# EAGLE design DG5v2_0_3 (EAGLE 9.5.2)
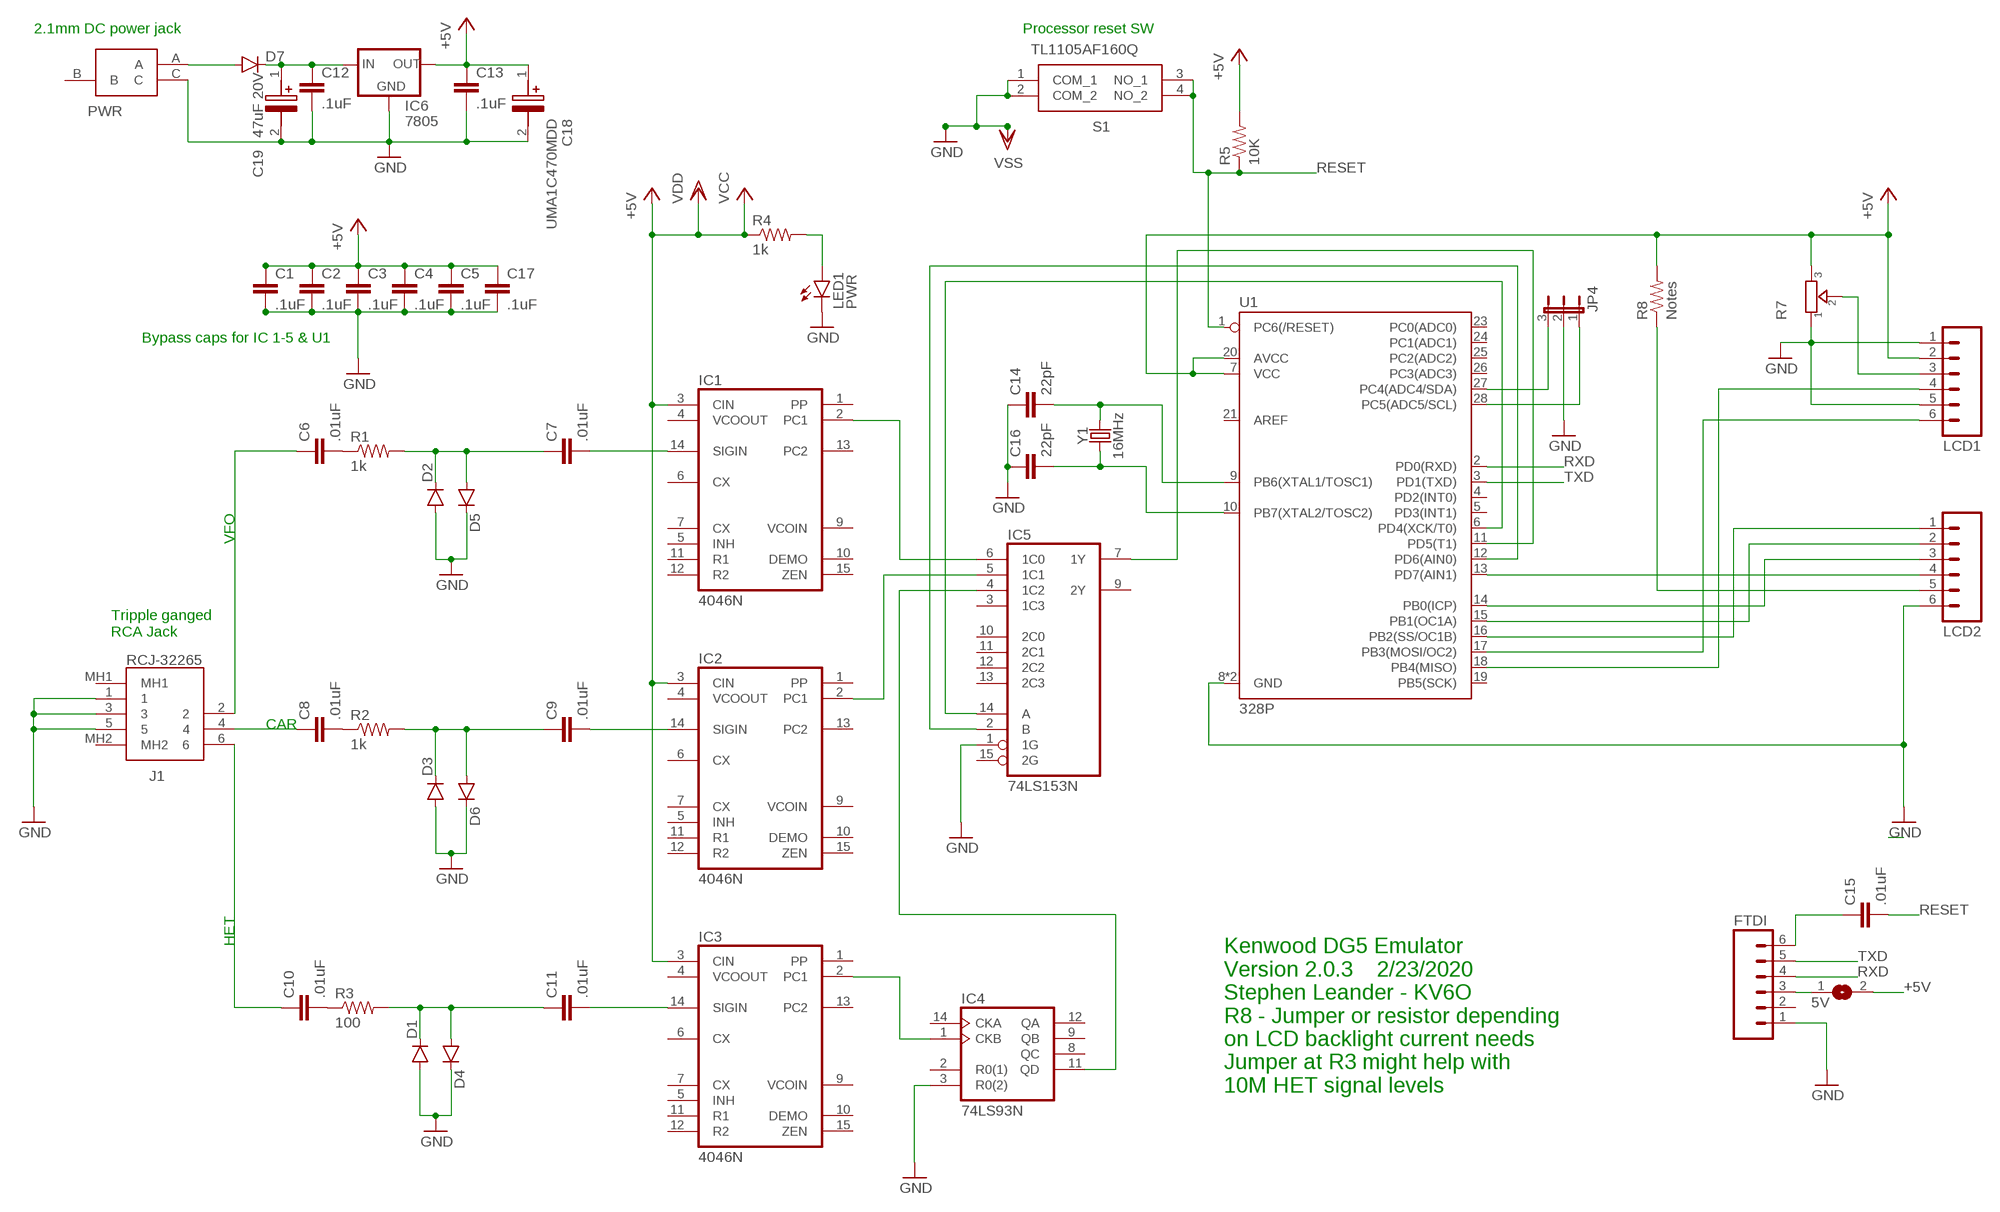
[diagram p0: schematic, sheet 1]

## Parts
5V  SJ  [SJ]
C1  .1uF  CAPKIT  [CAP-PTH-SMALL-KIT]
C2  .1uF  CAPKIT  [CAP-PTH-SMALL-KIT]
C3  .1uF  CAPKIT  [CAP-PTH-SMALL-KIT]
C4  .1uF  CAPKIT  [CAP-PTH-SMALL-KIT]
C5  .1uF  CAPKIT  [CAP-PTH-SMALL-KIT]
C6  .01uF  CAPKIT  [CAP-PTH-SMALL-KIT]
C7  .01uF  CAPKIT  [CAP-PTH-SMALL-KIT]
C8  .01uF  CAPKIT  [CAP-PTH-SMALL-KIT]
C9  .01uF  CAPKIT  [CAP-PTH-SMALL-KIT]
C10  .01uF  CAPKIT  [CAP-PTH-SMALL-KIT]
C11  .01uF  CAPKIT  [CAP-PTH-SMALL-KIT]
C12  .1uF  CAPKIT  [CAP-PTH-SMALL-KIT]
C13  .1uF  CAPKIT  [CAP-PTH-SMALL-KIT]
C14  22pF  CAPPTH  [CAP-PTH-SMALL]
C15  .01uF  CAPKIT  [CAP-PTH-SMALL-KIT]
C16  22pF  CAPPTH  [CAP-PTH-SMALL]
C17  .1uF  CAPKIT  [CAP-PTH-SMALL-KIT]
C18  UMA1C470MDD  [CAPPRD250W45D680H600]
C19  47uF 20V  UMA1C470MDD  [CAPPRD250W45D680H600]
D1  DIODE1N4148  [DIODE-1N4148]
D2  DIODE1N4148  [DIODE-1N4148]
D3  DIODE1N4148  [DIODE-1N4148]
D4  DIODE1N4148  [DIODE-1N4148]
D5  DIODE1N4148  [DIODE-1N4148]
D6  DIODE1N4148  [DIODE-1N4148]
D7  DIODE  [DIODE-1N4001-KIT]
FTDI  M06SIP  [1X06]
IC1  4046N  [DIL16]
IC2  4046N  [DIL16]
IC3  4046N  [DIL16]
IC4  74LS93N  [DIL14]
IC5  74LS153N  [DIL16]
IC6  7805  V_REG_78XXSINK  [TO220-IGO]
J1  RCJ-32265  [RCJ32265]
JP4  JP2E  [JP2]
LCD1  M06SIP  [1X06]
LCD2  M06SIP  [1X06]
LED1  PWR  TLLG4400  [LED3MM]
PWR  163-179PH-EX  [163179PHEX]
R1  1k  RESISTORPTH-1/6W  [1/6W-RES]
R2  1k  RESISTORPTH-1/6W  [1/6W-RES]
R3  100  RESISTORPTH-1/6W  [1/6W-RES]
R4  1k  RESISTORPTH-1/6W  [1/6W-RES]
R5  10K  RESISTORPTH-1/6W  [1/6W-RES]
R7  TRIMMER-3306F  [TRIMMER_3306F]
R8  Notes  RESISTORPTH-1/6W  [1/6W-RES]
S1  TL1105AF160Q  [TL1105AF160Q]
U1  328P  ATMEGA328P_PDIP  [DIP28]
Y1  16MHz  CRYSTAL-16MHZPTH-HC49US  [HC49US]

## Nets
+5V [POWER]: 5V.2 C1.1 C2.1 C3.1 C4.1 C5.1 C13.1 C17.1 C18.1(+) IC1.3(CIN) IC2.3(CIN) IC3.3(CIN) IC6.OUT LCD1.2 R4.1 R5.2 R7.3 R8.2 U1.7(VCC) U1.20(AVCC) ; supply symbol labelled VDD, VCC
CAR: C8.1 J1.4
GND: C1.2 C2.2 C3.2 C4.2 C5.2 C12.2 C13.2 C14.1 C16.1 C17.2 C18.2(-) C19.2(-) D1.A D2.A D3.A D4.C D5.C D6.C FTDI.1 IC4.3(R0(2)) IC5.1(1G) IC6.GND J1.1 J1.3 J1.5 JP4.2 LCD1.1 LCD1.5 LCD2.6 LED1.K(C) PWR.C R7.1 S1.1(COM_1) S1.2(COM_2) U1.8(GND) U1.22(GND) ; supply symbol labelled VSS
HET: C10.1 J1.6
N$1: C7.2 IC1.14(SIGIN)
N$2: IC1.2(PC1) IC5.6(1C0)
N$3: IC2.2(PC1) IC5.5(1C1)
N$4: C8.2 R2.1
N$5: C6.2 R1.1
N$6: C7.1 D2.C D5.A R1.2
N$7: IC3.2(PC1) IC4.1(CKB)
N$8: IC4.11(QD) IC5.4(1C2)
N$9: C9.1 D3.C D6.A R2.2
N$10: 5V.1 FTDI.3
N$11: C9.2 IC2.14(SIGIN)
N$12: C11.2 IC3.14(SIGIN)
N$13: C11.1 D1.C D4.A R3.2
N$14: C10.2 R3.1
N$17: IC5.7(1Y) U1.11(PD5(T1))
N$18: IC5.2(B) U1.12(PD6(AIN0))
N$19: IC5.14(A) U1.6(PD4(XCK/T0))
N$20: C14.2 U1.9(PB6(XTAL1/TOSC1)) Y1.2
N$21: LED1.A R4.2
N$22: JP4.3 U1.27(PC4(ADC4/SDA))
N$23: JP4.1 U1.28(PC5(ADC5/SCL))
N$24: C16.2 U1.10(PB7(XTAL2/TOSC2)) Y1.1
N$25: LCD2.5 R8.1
N$26: LCD1.3 R7.2
N$27: LCD1.4 U1.18(PB4(MISO))
N$28: LCD1.6 U1.17(PB3(MOSI/OC2))
N$29: C15.1 FTDI.6
N$32: D7.A PWR.A
N$34: LCD2.1 U1.16(PB2(SS/OC1B))
N$35: LCD2.2 U1.15(PB1(OC1A))
N$36: LCD2.3 U1.14(PB0(ICP))
N$37: LCD2.4 U1.13(PD7(AIN1))
RESET: C15.2 R5.1 S1.3(NO_1) S1.4(NO_2) U1.1(PC6(/RESET))
RXD: FTDI.4 U1.2(PD0(RXD))
TXD: FTDI.5 U1.3(PD1(TXD))
VFO: C6.1 J1.2
VIN [POWER]: C12.1 C19.1(+) D7.C IC6.IN
Unconnected: FTDI.2 IC1.1(PP) IC1.4(VCOOUT) IC1.5(INH) IC1.6(CX) IC1.7(CX) IC1.9(VCOIN) IC1.10(DEMO) IC1.11(R1) IC1.12(R2) IC1.13(PC2) IC1.15(ZEN) IC2.1(PP) IC2.4(VCOOUT) IC2.5(INH) IC2.6(CX) IC2.7(CX) IC2.9(VCOIN) IC2.10(DEMO) IC2.11(R1) IC2.12(R2) IC2.13(PC2) IC2.15(ZEN) IC3.1(PP) IC3.4(VCOOUT) IC3.5(INH) IC3.6(CX) IC3.7(CX) IC3.9(VCOIN) IC3.10(DEMO) IC3.11(R1) IC3.12(R2) IC3.13(PC2) IC3.15(ZEN) IC4.2(R0(1)) IC4.8(QC) IC4.9(QB) IC4.12(QA) IC4.14(CKA) IC5.3(1C3) IC5.9(2Y) IC5.10(2C0) IC5.11(2C1) IC5.12(2C2) IC5.13(2C3) IC5.15(2G) J1.MH1 J1.MH2 PWR.B U1.4(PD2(INT0)) U1.5(PD3(INT1)) U1.19(PB5(SCK)) U1.21(AREF) U1.23(PC0(ADC0)) U1.24(PC1(ADC1)) U1.25(PC2(ADC2)) U1.26(PC3(ADC3))

## Notes on the sheet
- 2.1mm DC power jack | Processor reset SW
- Bypass caps for IC 1-5 & U1
- VFO
- Tripple ganged
  RCA Jack
- CAR
- HET
- Kenwood DG5 Emulator
  Version 2.0.3    2/23/2020
  Stephen Leander - KV6O
  R8 - Jumper or resistor depending 
  on LCD backlight current needs
  Jumper at R3 might help with
  10M HET signal levels

## Power pins joined to a net without a drawn wire
+5V: IC1.16(VDD) IC2.16(VDD) IC3.16(VDD) IC4.5(VCC) IC5.16(VCC)
GND: IC1.8(VSS) IC2.8(VSS) IC3.8(VSS) IC4.10(GND) IC5.8(GND)

## Library data of the parts
5V = jumper:SJ: SMD solder JUMPER
C1-C13 C15 C17 = SparkFun-Passives:CAP: Capacitor Standard 0603 ceramic capacitor, and 0.1" leaded capacitor.
C14 C16 = SparkFun:CAP: Capacitor Standard 0603 ceramic capacitor, and 0.1" leaded capacitor.
C18 C19 = SamacSys_Parts:UMA1C470MDD: Nichicon 47F +/-20% 16 V dc Through Hole Radial Aluminium Electrolytic Capacitor Source: Datasheet <https://componentsearchengine.com/Datasheets/1/UMA1C470MDD.pdf>; DESCRIPTION: Nichicon 47F +/-20% 16 V dc Through Hole Radial Aluminium Electrolytic Capacitor; HEIGHT: 6mm; MANUFACTURER_NAME: Nichicon; MANUFACTURER_PART_NUMBER: UMA1C470MDD; MOUSER_PART_NUMBER: 647-UMA1C470MDD
D1-D7 = SparkFun-DiscreteSemi:DIODE: Diode These are standard reverse protection diodes and small signal diodes. SMA package can handle up to about 1A. SOD-323 can handle about 200mA. What the SOD-323 package when ordering, there are some mfgs out there that are 5-pin packages.
FTDI LCD1 LCD2 = SparkFun-Connectors:M06: Header 6 Standard 6-pin 0.1" header. Use with straight break away headers (SKU : PRT-00116), right angle break away headers (PRT-00553), swiss pins (PRT-00743), machine pins (PRT-00117), and female headers (PRT-00115). Molex polarized connector foot print use with SKU : PRT-08094 with associated crimp pins and housings. NOTES ON THE VARIANTS LOCK and LOCK_LONGPADS... This footprint was designed to help hold the alignment of a through-hole component (i.e. 6-pin header) while soldering it into place. You may notice that each hole has been shifted either up or down by 0.005 of an inch from it's more standard position (which is a perfectly straight line). This slight alteration caused the pins (the squares in the middle) to touch the edges of the holes. Because they are alternating, it causes a "brace" to hold the component in place. 0.005 has proven to be the perfect amount of "off-center" position when using our standard breakaway headers. Although looks a little odd when you look at the bare footprint, once you have a header in there, the alteration is very hard to notice. Also,if you push a header all the way into place, it is covered up entirely on the bottom side. This idea of altering the position of holes to aid alignment will be further integrated into the Sparkfun Library for other footprints. It can help hold any component with 3 or more connection pins.
IC1-IC3 = 40xx:4046: Micropower PLL
IC4 = 74xx-us:74*93: Decade, divide by twelve and binary COUNTER
IC5 = 74xx-us:74*153: Dual 4-line to 1-line data SELECTOR/MULTIPLEXER
IC6 = SparkFun-PowerIC:V_REG_78XX: Voltage Regulator Standard 7805 5V regulator. IGO (Input Ground Output). Spark Fun Electronics SKU : COM-00107
J1 = SamacSys_Parts:RCJ-32265: RCA Phono Connectors RCA jack, 3P, 1 x 3, rt, through hole, BE/GR/RD Source: Datasheet <https://componentsearchengine.com/Datasheets/1/RCJ-32265.pdf>; DESCRIPTION: RCA Phono Connectors RCA jack, 3P, 1 x 3, rt, through hole, BE/GR/RD; HEIGHT: 19.2mm; MANUFACTURER_NAME: CUI; MANUFACTURER_PART_NUMBER: RCJ-32265; MOUSER_PART_NUMBER: 490-RCJ-32265; MOUSER_PRICE-STOCK: https://www.mouser.com/Search/Refine.aspx?Keyword=490-RCJ-32265
JP4 = jumper:JP2E: JUMPER
LED1 = led:TLLG4400: Low Current (2mA) LED 3 mm Tinted Diffused Package color GREEN Source: Data sheet <http://www.farnell.com/datasheets/391098.pdf>; MF: VISHAY SEMICONDUCTOR; OC_FARNELL: 1612435
PWR = SamacSys_Parts:163-179PH-EX: DC Power Connectors PCB 2.1MM Source: Datasheet <https://componentsearchengine.com/Datasheets/1/163-179PH-EX.pdf>; DESCRIPTION: DC Power Connectors PCB 2.1MM; HEIGHT: 11mm; MANUFACTURER_NAME: Kobiconn; MANUFACTURER_PART_NUMBER: 163-179PH-EX; MOUSER_PART_NUMBER: 163-179PH-EX; MOUSER_PRICE-STOCK: https://www.mouser.com/Search/Refine.aspx?Keyword=163-179PH-EX
R1-R5 R8 = SparkFun-Passives:RESISTOR: Resistor Basic schematic elements and footprints for 0603, 1206, and PTH resistors.
R7 = dp_devices:TRIMMER: Trimmer resistor
S1 = SamacSys_Parts:TL1105AF160Q: E-SWITCH - TL1105AF160Q - SWITCH, TACTILE SPST, 50mA, THROUGH HOLE Source: Datasheet <https://componentsearchengine.com/Datasheets/1/TL1105AF160Q.pdf>; DESCRIPTION: E-SWITCH - TL1105AF160Q - SWITCH, TACTILE SPST, 50mA, THROUGH HOLE; HEIGHT: 6.8mm; MANUFACTURER_NAME: E-Switch; MANUFACTURER_PART_NUMBER: TL1105AF160Q; MOUSER_PART_NUMBER: 612-TL1105A; MOUSER_PRICE-STOCK: https://www.mouser.com/Search/Refine.aspx?Keyword=612-TL1105A
U1 = SparkFun-IC-Microcontroller:ATMEGA328P_PDIP: Atmel 328P Through hole ATMEGA328P uC used in the Arduino 32kb flash, 1k EEPROM, 2k SRAM Datasheet <http://www.sparkfun.com/datasheets/Components/SMD/ATMega328.pdf> SparkFun Products Storefront component: AVR 28 Pin 20MHz 32K 6A/D - ATMega328P <https://www.sparkfun.com/products/9061> (COM-09061) SparkFun Simon Says - Through-Hole Soldering Kit <https://www.sparkfun.com/products/10547> (KIT-10547) SparkFun Learn to Solder - Simon Says <https://www.sparkfun.com/products/13708> (KIT-13708) SparkFun BigTime Watch Kit <https://www.sparkfun.com/products/11734> (KIT-11734) SparkFun ClockIt <https://www.sparkfun.com/products/10930> (KIT-10930) SparkFun Serial Enabled LCD Kit <https://www.sparkfun.com/products/10097> (LCD-10097) SparkFun Simon Tilts - Through Hole Soldering Kit <https://www.sparkfun.com/products/12634> (KIT-12634) SparkFun Frequency Counter Kit <https://www.sparkfun.com/products/10140> (KIT-10140) FabFM Radio Kit <https://www.sparkfun.com/products/11043> (KIT-11043) SparkFun Binary Blaster Kit <https://www.sparkfun.com/products/12037> (KIT-12037) SparkFun Metro-Gnome <https://www.sparkfun.com/products/9236> (KIT-09236) ATmega328 with Arduino Optiboot (Uno) <https://www.sparkfun.com/products/10524> (DEV-10524); PROD_ID: IC-09136
Y1 = SparkFun-Clocks:CRYSTAL-16MHZ: 16MHz Crystal Digikey Example <http://www.digikey.com/product-search/en?keywords=535-9122-1-ND> Frequency: 16MHz Frequency Stability: ±50ppm Frequency Tolerance: ±20ppm Load Capacitance: 18pF SparkFun Products: Pro Micro -5V/16MHz <https://www.sparkfun.com/products/12640> SparkFun Serial Enabled LCD Kit <https://www.sparkfun.com/products/10097>; PROD_ID: XTAL-08181; SF_ID: COM-00536

## Net classes
0 default: width 0.203 mm
1 POWER: width 0.305 mm

## Board
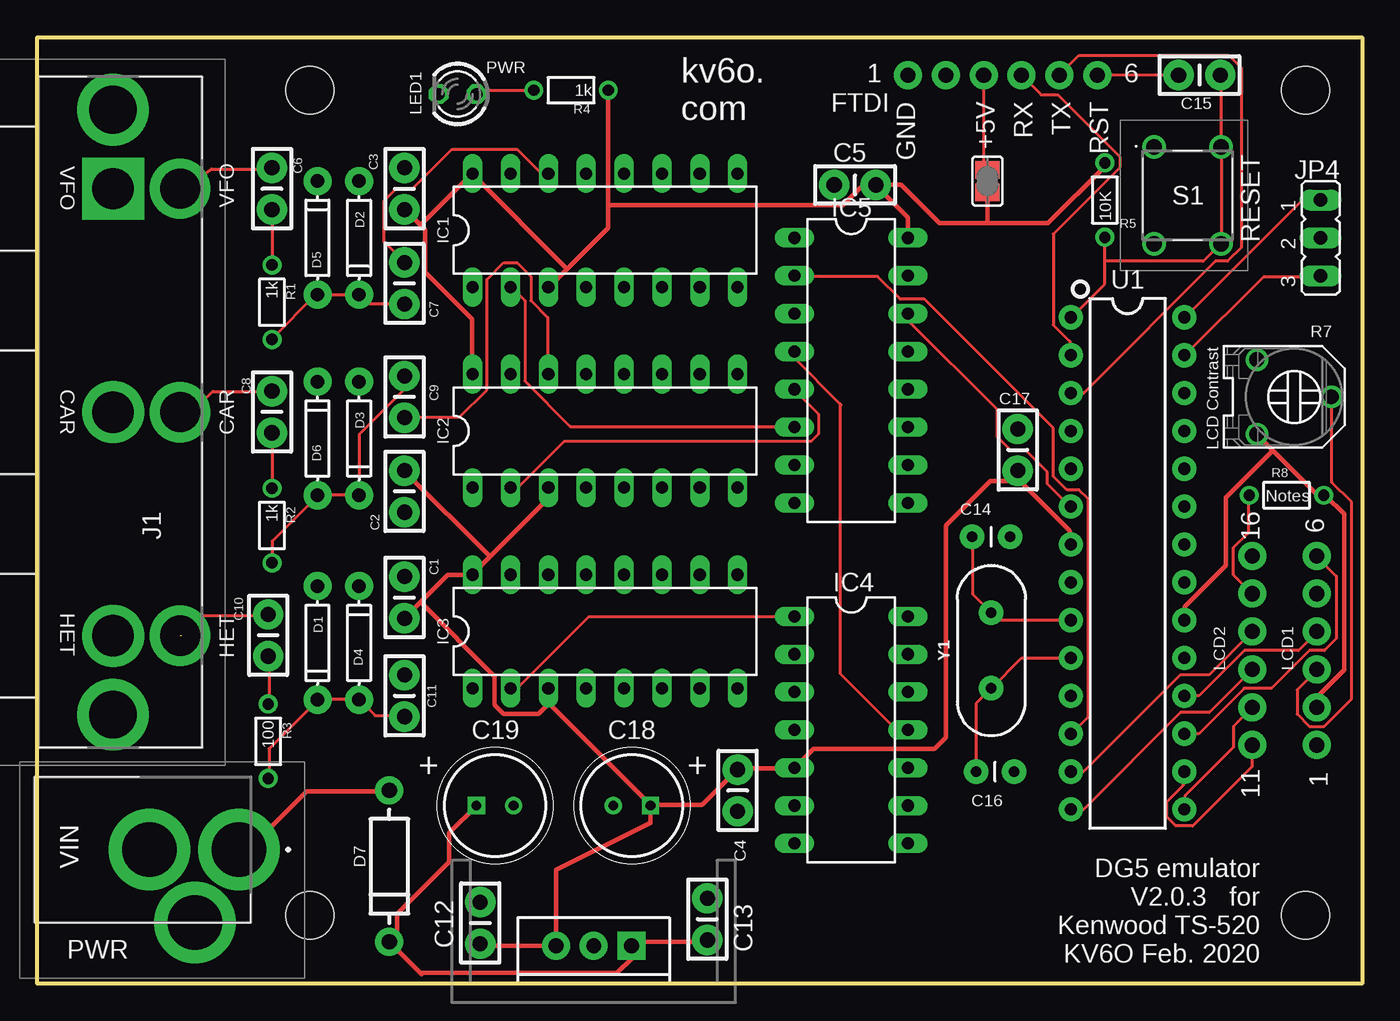
[diagram p1: board, top side]
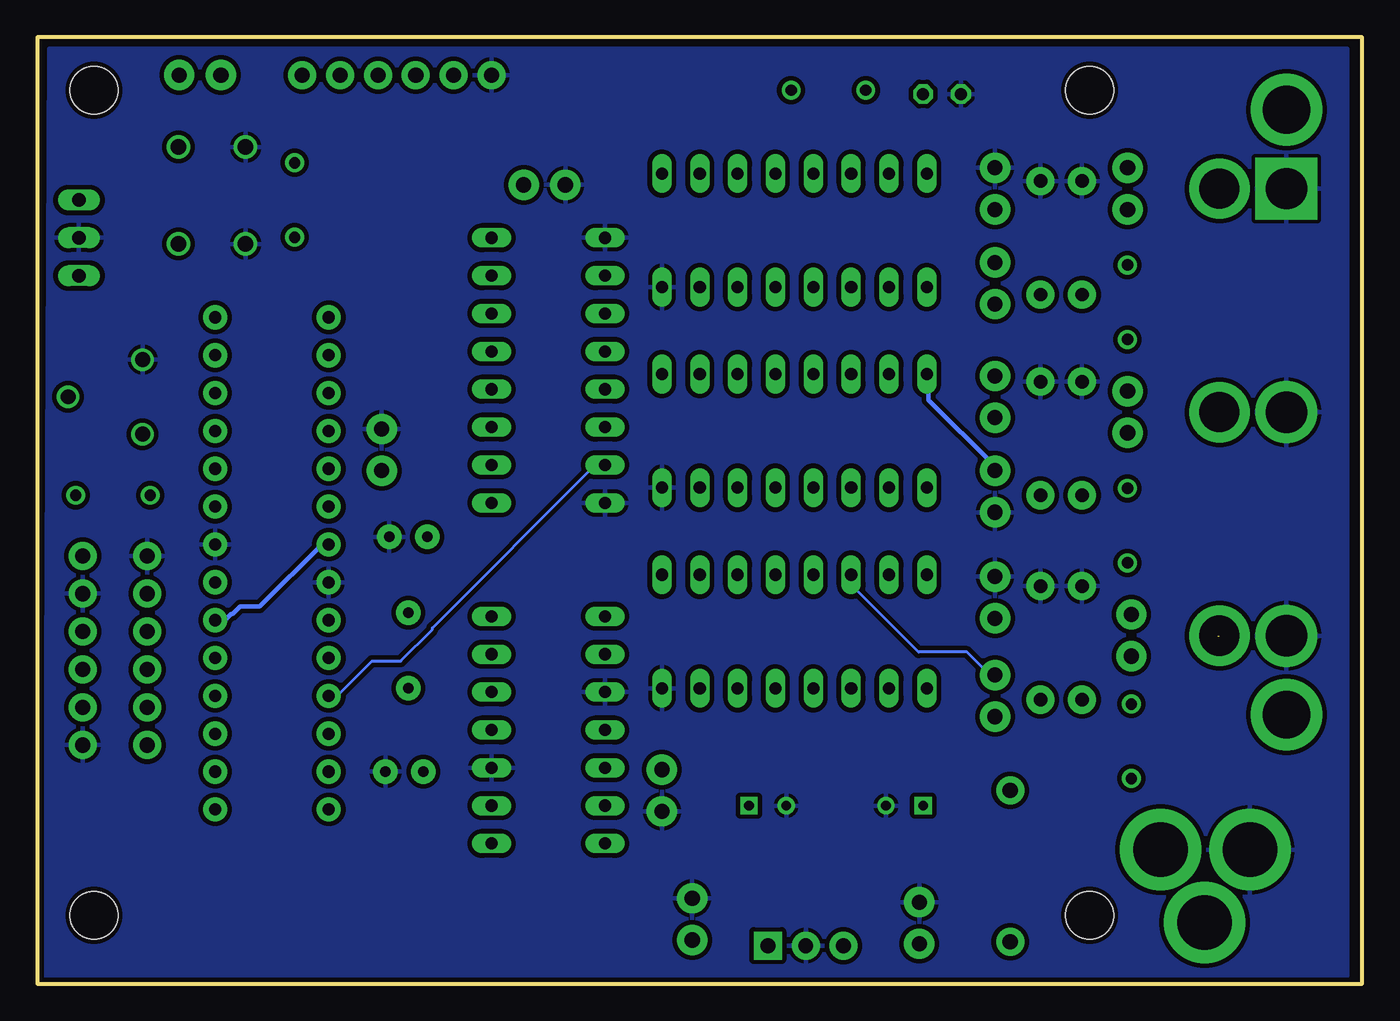
[diagram p2: board, bottom side, seen from below]

Size 88.9 x 63.5 mm. Coordinates in mm from the lower left corner, seen from the top.
Outline: 0,0 0,63.5 88.9,63.5 88.9,0 0,0
Copper layers (1*16): Top 0.035mm / dielectric 1.5mm / Bottom 0.035mm
Design rules "ITEADstudio_DRC *": minimum track width 8mil, minimum drill 12mil, track to track 8mil, track to pad 8mil, pad to pad 8mil, via to via 8mil, smd to smd 0mil, copper to edge 10mil, drill to drill 10mil, minimum pad ring 10mil, minimum via ring 6mil, stop-mask expansion 2mil, vias tented up to drill 100mil, thermal gap 10mil
Holes 3.2 mm at 18.29,59.94 18.29,4.57 85.09,4.57 85.09,59.94

### Footprints (pad centres in the part's own frame; a part is rotated, then mirrored left to right if it is on the bottom)
SJ = smd 1.168 x 1.6: 1 -0.762,0; 2 0.762,0
CAP-PTH-SMALL-KIT = drill 1.016 pad 2.032: 1 -1.397,0; 2 1.397,0
CAP-PTH-SMALL = drill 0.7 pad 1.651: 1 0,0; 2 2.54,0
CAPPRD250W45D680H600 = drill 0.65 pad 1.05 square: 1 0,0 | drill 0.65 pad 1.05: 2 2.5,0
DIODE-1N4148 = drill 0.9 pad 1.88: A -3.81,0; C 3.81,0
DIODE-1N4001-KIT = drill 1.016 pad 1.88: A -5.08,0; C 5.08,0
1X06 = drill 1.016 pad 1.88: 1 0,0; 2 2.54,0; 3 5.08,0; 4 7.62,0; 5 10.16,0; 6 12.7,0
DIL16 = drill 0.813 long: 1 -8.89,-3.81; 2 -6.35,-3.81; 3 -3.81,-3.81; 4 -1.27,-3.81; 5 1.27,-3.81; 6 3.81,-3.81; 7 6.35,-3.81; 8 8.89,-3.81; 9 8.89,3.81; 10 6.35,3.81; 11 3.81,3.81; 12 1.27,3.81; 13 -1.27,3.81; 14 -3.81,3.81; 15 -6.35,3.81; 16 -8.89,3.81
DIL14 = drill 0.813 long: 1 -7.62,-3.81; 2 -5.08,-3.81; 3 -2.54,-3.81; 4 0,-3.81; 5 2.54,-3.81; 6 5.08,-3.81; 7 7.62,-3.81; 8 7.62,3.81; 9 5.08,3.81; 10 2.54,3.81; 11 0,3.81; 12 -2.54,3.81; 13 -5.08,3.81; 14 -7.62,3.81
TO220-IGO = drill 1 pad 1.88: GND 0,0; OUT 2.54,0 | drill 1 pad 1.88 square: IN -2.54,0
RCJ32265 = drill 2.773 pad 4.16 square: 1 0,0 | drill 2.693 pad 4.039: 2 0,-4.5; 4 -15,-4.5; 6 -30,-4.5 | drill 2.773 pad 4.16: 3 -15,0; 5 -30,0 | drill 3.202 pad 4.802: MH1 5.3,0; MH2 -35.3,0
JP2 = drill 0.914 long: 1 -2.54,0; 2 0,0; 3 2.54,0
LED3MM = drill 0.813 octagon: A -1.27,0; K 1.27,0
163179PHEX = drill 3.64 pad 5.46: A 5.15,1.365; B 2.2,-3.535; C -0.85,1.365
1/6W-RES = drill 0.762: 1 -2.5,0; 2 2.5,0
TRIMMER_3306F = drill 1: 1 -2.5,-2.5; 2 0,2.5; 3 2.5,-2.5
TL1105AF160Q = drill 1.05 pad 1.575: 1 0,0; 2 0,-6.5; 3 4.5,0; 4 4.5,-6.5
DIP28 = drill 0.813 pad 1.626: 1 -16.51,-3.81; 2 -13.97,-3.81; 3 -11.43,-3.81; 4 -8.89,-3.81; 5 -6.35,-3.81; 6 -3.81,-3.81; 7 -1.27,-3.81; 8 1.27,-3.81; 9 3.81,-3.81; 10 6.35,-3.81; 11 8.89,-3.81; 12 11.43,-3.81; 13 13.97,-3.81; 14 16.51,-3.81; 15 16.51,3.81; 16 13.97,3.81; 17 11.43,3.81; 18 8.89,3.81; 19 6.35,3.81; 20 3.81,3.81; 21 1.27,3.81; 22 -1.27,3.81; 23 -3.81,3.81; 24 -6.35,3.81; 25 -8.89,3.81; 26 -11.43,3.81; 27 -13.97,3.81; 28 -16.51,3.81
HC49US = drill 0.7 pad 1.651: 1 -2.54,0; 2 2.54,0

### Placement (x,y rotation side)
5V  63.75,53.85 270 top
C1  24.64,25.91 90 top
C2  24.64,33.02 270 top
C3  24.64,53.34 90 top
C4  46.99,12.95 270 top
C5  54.86,53.59 180 top
C6  15.75,53.34 270 top
C7  24.64,46.99 90 top
C8  15.75,38.35 270 top
C9  24.64,39.37 270 top
C10  15.49,23.37 270 top
C11  24.64,19.3 90 top
C12  44.96,4.32 90 top
C13  29.72,4.06 90 top
C14  65.28,29.97 180 top
C15  77.98,60.96 0 top
C16  65.53,14.22 180 top
C17  65.79,35.81 90 top
C18  41.15,11.94 180 top
C19  29.46,11.94 0 top
D1  18.8,22.86 270 top
D2  21.59,50.04 270 top
D3  21.59,36.58 270 top
D4  21.59,22.86 90 top
D5  18.8,50.04 90 top
D6  18.8,36.58 90 top
D7  23.62,7.87 270 top
FTDI  58.42,60.96 0 top
IC1  38.1,50.55 0 top
IC2  38.1,37.08 0 top
IC3  38.1,23.62 0 top
IC4  54.61,17.02 270 top
IC5  54.61,41.15 270 top
IC6  37.34,2.54 180 top
J1  5.08,53.34 90 top
JP4  86.11,50.04 270 top
LCD1  85.85,16 90 top
LCD2  81.53,16 90 top
LED1  28.19,59.69 180 top
PWR  8.38,7.62 0 top
R1  15.75,45.72 270 top
R2  15.75,30.73 270 top
R3  15.49,16.26 270 top
R4  35.81,59.94 180 top
R5  71.63,52.58 90 top
R7  84.33,39.37 270 top
R8  83.82,32.77 0 top
S1  74.93,56.13 0 top
U1  73.15,28.19 270 top
Y1  64.01,22.35 90 top

### Tracks (layer width: path | path; a pad name or v marks a point on that pad's centre or on a via)
+5V
  Top 0.305: IC5.16 58.42,51.41 56.29,53.54 C5.1 | 38.3,52.22 38.3,50.7 35.56,47.95 | 38.3,52.22 R4.1 | 35.56,47.95 34.34,46.74 IC1.3 | 25.7,50.9 24.69,51.92 C3.1 | 25.7,50.9 26.01,50.6 26.01,47.75 29.16,44.6 29.16,40.95 IC2.16 | 25.7,50.9 29.16,54.36 IC1.16 29.26,54.25 35.56,47.95 | 38.3,52.22 54.05,52.22 55.27,53.44 56.19,53.44 C5.1 | U1.7 69.29,29.46 69.29,30.38 65.84,33.83 65.84,34.34 C17.1 65.73,33.73 63.96,33.73 60.96,30.73 60.96,16.51 60.2,15.75 52.07,15.75 IC4.5 | 82.91,35.76 81.89,36.78 R7.3 | 82.91,35.76 85.85,32.82 86.26,32.82 R8.2 86.46,32.72 87.68,31.5 87.68,21.03 85.85,19.2 LCD1.2 | 82.91,35.76 79.76,32.61 79.76,28.04 77.01,25.3 77.01,24.38 U1.20 | 25.7,25.6 24.69,24.59 C1.1 | 25.7,25.6 27.53,27.43 IC3.16 29.26,27.53 30.38,28.65 | 30.38,28.65 34.24,32.51 34.24,33.22 IC2.3 | 30.38,28.65 24.69,34.34 C2.1 | C13.1 29.78,2.54 IC6.OUT 34.8,7.62 41.15,10.79 C18.1 | C18.1 41.15,11.99 44.6,11.99 46.94,14.33 C4.1 47.04,14.43 50.8,14.43 IC4.5 | C18.1 41.05,12.09 34.34,18.8 34.34,19.81 IC3.3 34.24,18.69 33.63,18.09 31.29,18.09 30.68,18.69 30.68,20.62 25.7,25.6 | 50.9,14.53 IC4.5 | C5.1 57.96,53.59 60.54,51.01 63.75,51.01 | R5.2 71.63,54.82 67.82,51.01 63.75,51.01 | 5V.2 63.75,51.01
  Bottom 0.305: U1.7 69.8,29.46 73.97,25.3 75.29,25.3 75.79,24.79 75.89,24.79 76.3,24.38 U1.20 | IC2.16 29.16,40.84 29.16,39.73 29.11,39.67 29.11,39.17 24.69,34.75 24.69,34.44 C2.1
CAR
  Top 0.203: C8.1 15.75,39.73 11.79,39.73 10.6,38.54 J1.4
GND
  pour Bottom (isolate 0.305): 1.02,62.74 1.02,0.51 88.39,0.51 88.09,62.74
HET  (1 unrouted)
  Top 0.203: C10.1 15.44,24.69 11.18,24.69 9.7,23.34
N$1
  Top 0.203: IC1.14 33.83,54.36 32.21,55.98 27.84,55.98 25.2,53.34 24.08,53.34 23.27,52.53 23.27,49.78 24.59,48.46 C7.2
N$2
  Top 0.203: IC5.6 50.8,37.39 35.76,37.39 32.72,40.44 32.72,45.82 31.8,46.74 IC1.2
N$3
  Top 0.203: IC2.2 31.8,33.33 32.31,33.33 35.36,36.37 51.92,36.37 52.43,36.88 52.43,38.2 50.8,39.83 IC5.5
N$4
  Top 0.203: C8.2 R2.1
N$5
  Top 0.203: C6.2 R1.1
N$6
  Top 0.203: R1.2 15.75,43.28 18.69,46.23 D5.A D2.C 21.64,46.23 22.25,45.62 24.59,45.62 C7.1
N$7
  Top 0.203: IC3.2 32.21,19.81 36.98,24.59 50.8,24.59 IC4.1
N$8
  Top 0.203: IC5.4 50.8,41.96 53.87,38.89 | 53.95,38.81 53.87,38.89 | 57.66,17.02 54.1,20.57 53.95,20.73 53.87,20.8 53.87,38.89
  Top 0.305: 57.66,17.02 IC4.11
  Bottom 0.203: 57.61,17.07 58.42,17.07 IC4.11
N$9
  Top 0.203: R2.2 15.75,29.67 18.8,32.72 D6.A 18.8,32.82 21.54,32.82 D3.C 21.64,32.82 21.64,36.88 24.59,39.83 24.59,40.74 C9.1
N$10
  Top 0.203: 5V.1 63.5,54.86 FTDI.3
N$11
  Top 0.203: IC2.14 34.24,40.95 34.24,44.7 33.12,45.82 33.12,47.45 32.21,48.36 31.29,48.36 30.18,47.24 30.18,39.83 28.35,38 24.69,38 C9.2
N$12
  Bottom 0.203: IC3.14 34.24,27.43 34.24,26.72 29.77,22.25 26.52,22.25 24.99,20.73 24.69,20.73 C11.2
N$13
  Top 0.203: R3.2 15.54,13.82 15.54,15.75 18.8,19 D1.C 18.8,19.1 21.54,19.1 D4.A 22.66,17.98 24.59,17.98 C11.1
N$14
  Top 0.203: R3.1 15.54,18.8 15.54,21.95 C10.2
N$17
  Bottom 0.203: U1.11 68.78,19.3 66.45,21.64 64.52,21.64 62.38,23.77 62.38,23.88 51.51,34.75 50.8,34.75 IC5.7
N$18
  Top 0.203: IC5.2 50.8,47.45 56.39,47.45 57.91,45.92 59.54,45.92 68.17,37.29 68.17,34.04 69.09,33.12 69.9,33.12 70.51,32.51 70.51,17.88 69.39,16.76 U1.12
N$19
  Top 0.203: IC5.14 58.42,44.5 64.41,38.51 64.41,36.68 65.33,35.76 66.34,35.76 67.77,34.34 67.77,33.53 69.29,32 U1.6
N$20
  Top 0.203: U1.9 64.52,24.38 Y1.2 62.79,26.11 62.79,29.97 C14.2
N$21
  Top 0.203: R4.2 29.67,59.94 29.46,59.74 LED1.A
N$22
  Top 0.203: JP4.3 86.06,47.45 82.3,47.45 77.01,42.16 U1.27
N$23
  Top 0.203: JP4.1 86.06,52.53 84.84,52.53 77.01,44.7 U1.28
N$24
  Top 0.203: U1.10 66.04,21.84 Y1.1 62.99,18.8 C16.2
N$25
  Top 0.203: LCD2.5 80.26,27.43 80.26,29.26 81.28,30.28 81.28,32.72 R8.1
N$26
  Top 0.203: R7.2 86.87,39.32 86.87,33.63 88.19,32.31 88.19,19.1 86.36,17.27 85.34,17.27 84.53,18.09 84.53,19.71 85.85,21.03 LCD1.3
N$27
  Top 0.203: U1.18 77.93,19.3 80.97,22.35 84.63,22.35 85.85,23.57 LCD1.4
N$28
  Top 0.203: U1.17 77.93,16.76 80.97,19.81 82.8,19.81 85.34,22.35 86.36,22.35 87.17,23.16 87.17,27.33 85.85,28.65 LCD1.6
N$29
  Top 0.203: C15.1 FTDI.6
N$32
  Top 0.203: 23.57,12.9 D7.A | PWR.A 14.17,8.98
  Top 0.305: 23.57,12.9 18.09,12.9 14.17,8.98
N$34
  Top 0.203: U1.16 76.91,14.22 76.91,13.31 75.79,12.19 75.79,11.18 76.4,10.57 77.52,10.57 81.48,14.53 81.48,15.95 LCD2.1
N$35
  Top 0.203: LCD2.2 80.26,17.27 80.26,15.85 77.01,12.6 77.01,11.68 U1.15
N$36
  Top 0.203: U1.14 70.21,11.68 76.71,18.19 78.64,18.19 LCD2.3
N$37
  Top 0.203: U1.13 70.21,14.22 76.71,20.73 78.64,20.73 LCD2.4
RESET
  Top 0.203: 71.63,48.46 71.63,46.94 69.39,44.7 U1.1 | 71.63,48.46 R5.1 | C15.2 79.45,60.96 79.45,56.19 S1.3 79.45,56.08 79.45,49.68 S1.4 79.35,49.58 78.23,48.46 71.63,48.46
RXD
  Top 0.203: FTDI.4 67.36,59.64 68.48,59.64 72.64,55.47 72.64,54.76 68.17,50.29 68.17,44.2 69.29,43.08 69.29,42.16 U1.2
TXD
  Top 0.203: U1.3 70.21,39.62 79.05,48.46 79.86,48.46 80.77,49.38 80.77,61.47 79.96,62.28 69.9,62.28 FTDI.5
VFO
  Top 0.203: C6.1 15.75,54.66 11.68,54.66 9.81,53.34 J1.2
VIN
  Top 0.305: C12.1 44.96,2.79 40.13,2.79 IC6.IN 39.88,1.68 38.91,0.71 25.76,0.71 25.78,0.64 D7.C 24.13,3.3 24.13,4.67 27.64,8.18 27.64,10.11 C19.1

### Text on the board
tNames: 1 | 6 | GND | +5V | RX | TX | RST | C15 | kv6o. / com | RESET | VFO | VFO | CAR | C17 | CAR | LCD Contrast | 16 | 6 | HET | HET | + | + | 1 | 11 | VIN | DG5 emulator / V2.0.3 for / Kenwood TS-520 / KV6O Feb. 2020 | C12 | C13